# EAGLE design Ilumitunes-IR-Breakout-v11 (EAGLE 5.10)
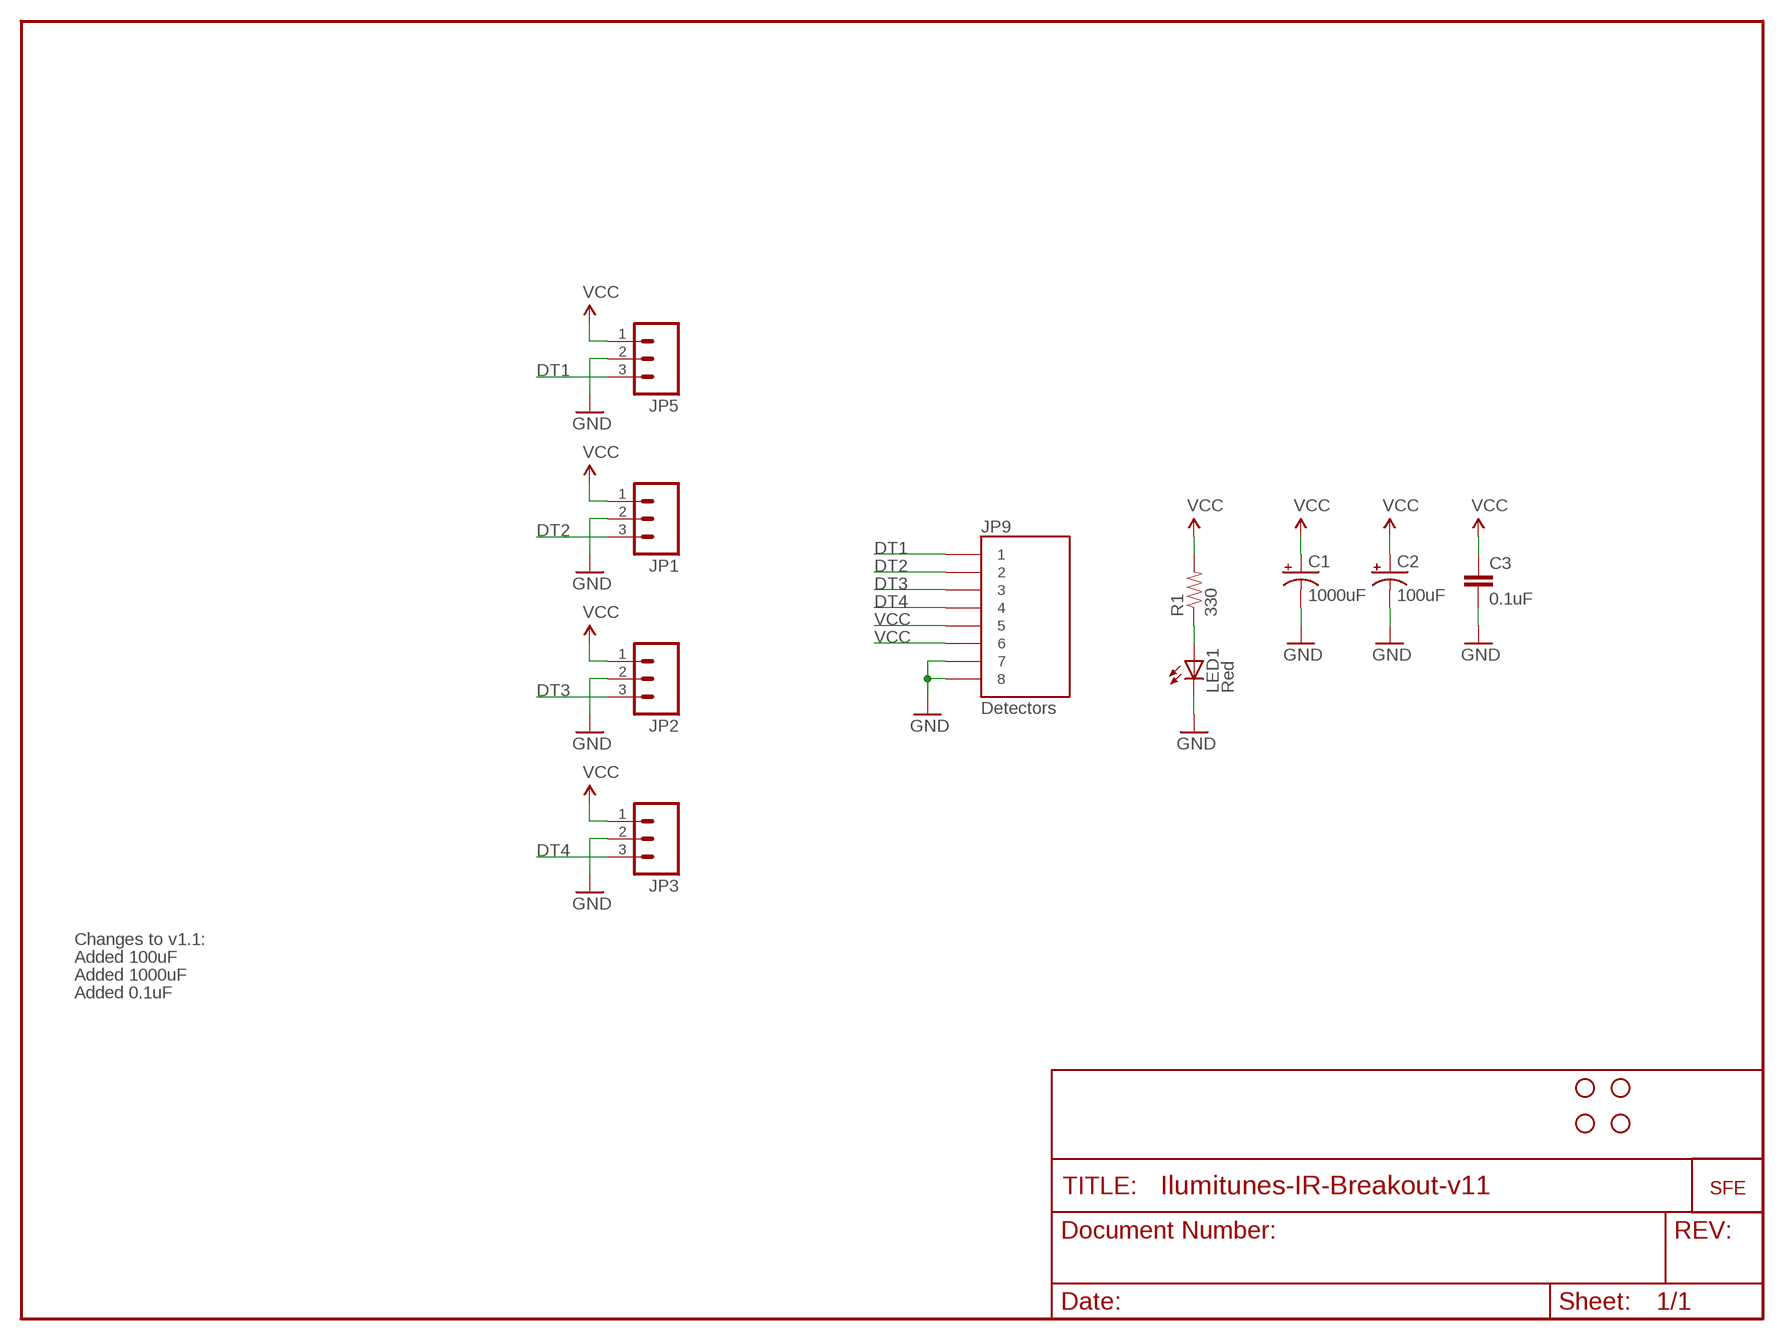
[diagram p0: schematic, sheet 1]

## Parts
C1  1000uF  CAP_POLPTH4  [CPOL-RADIAL-1000UF-25V]
C2  100uF  CAP_POLPTH1  [CPOL-RADIAL-100UF-25V]
C3  0.1uF  CAPPTH2  [CAP-PTH-SMALL2]
JP1  M03JST-PTH-VERT  [JST-3-PTH-VERT]
JP2  M03JST-PTH-VERT  [JST-3-PTH-VERT]
JP3  M03JST-PTH-VERT  [JST-3-PTH-VERT]
JP4  STAND-OFF  [STAND-OFF]
JP5  M03JST-PTH-VERT  [JST-3-PTH-VERT]
JP6  STAND-OFF  [STAND-OFF]
JP7  STAND-OFF  [STAND-OFF]
JP8  STAND-OFF  [STAND-OFF]
JP9  Detectors  RJ45-8PTH  [RJ45-8]
LED1  Red  LED5MM  [LED5MM]
R1  330  RESISTORAXIAL-0.3  [AXIAL-0.3]
U$1  LOGO-SFESK  [SFE-LOGO-FLAME]

## Nets
DT1: JP5.3 JP9.1
DT2: JP1.3 JP9.2
DT3: JP2.3 JP9.3
DT4: JP3.3 JP9.4
GND: C1.2(-) C2.2(-) C3.2 JP1.2 JP2.2 JP3.2 JP5.2 JP9.7 JP9.8 LED1.K(C)
N$1: LED1.A R1.P$1
VCC [vcc]: C1.1(+) C2.1(+) C3.1 JP1.1 JP2.1 JP3.1 JP5.1 JP9.5 JP9.6 R1.P$2

## Notes on the sheet
- Changes to v1.1:
- Added 100uF
- Added 1000uF
- Added 0.1uF

## Library data of the parts
C1 C2 = SparkFun:CAP_POL: Capacitor Polarized These are standard SMD and PTH capacitors. Normally 10uF, 47uF, and 100uF in electrolytic and tantalum varieties. Always verify the external diameter of the through hole cap, it varies with capacity, voltage, and manufacturer. The EIA devices should be standard.
C3 = SparkFun:CAP: Capacitor Standard 0603 ceramic capacitor, and 0.1" leaded capacitor.
JP1-JP3 JP5 = SparkFun:M03: Header 3 Standard 3-pin 0.1" header. Use with straight break away headers (SKU : PRT-00116), right angle break away headers (PRT-00553), swiss pins (PRT-00743), machine pins (PRT-00117), and female headers (PRT-00115). Molex polarized connector foot print use with SKU : PRT-08232 with associated crimp pins and housings.
JP4 JP6-JP8 = SparkFun:STAND-OFF: Stand Off This is the mechanical footprint for a #4 phillips button head screw. Use the keepout ring to avoid running the screw head into surrounding components. SKU : PRT-00447
JP9 = SparkFun:RJ45-8: RJ45 Jack Simple RJ45, 8-pin connection - connector for common Cat5, Cat5e, and Cat6 Ethernet cables. Footprint not yet proven in production. Connector sku is PRT-00643; Breakout PCB sku is BOB-00716.
LED1 = SparkFun:LED: LEDs Standard schematic elements and footprints for 5mm, 3mm, 1206, and 0603 sized LEDs. 5mm - Spark Fun Electronics SKU : COM-00529 (and others)
R1 = SparkFun:RESISTOR: Resistor Basic schematic elements and footprints for 0603, 1206, and PTH resistors.
U$1 = SparkFun:LOGO-SFE: Spark Fun Electronics PCB Logo This is the standard Spark Fun Electronics PCB logo.

## Net classes
1 vcc: width 0.508 mm

## Board
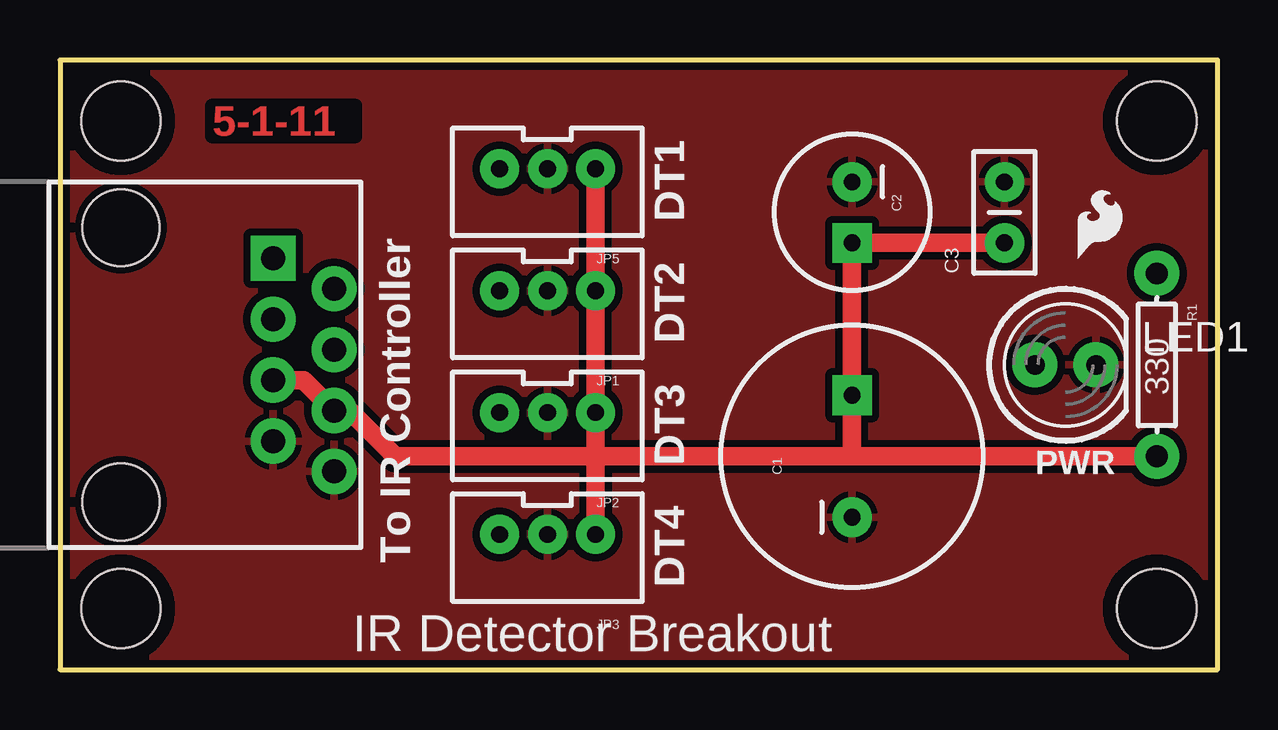
[diagram p1: board, top side]
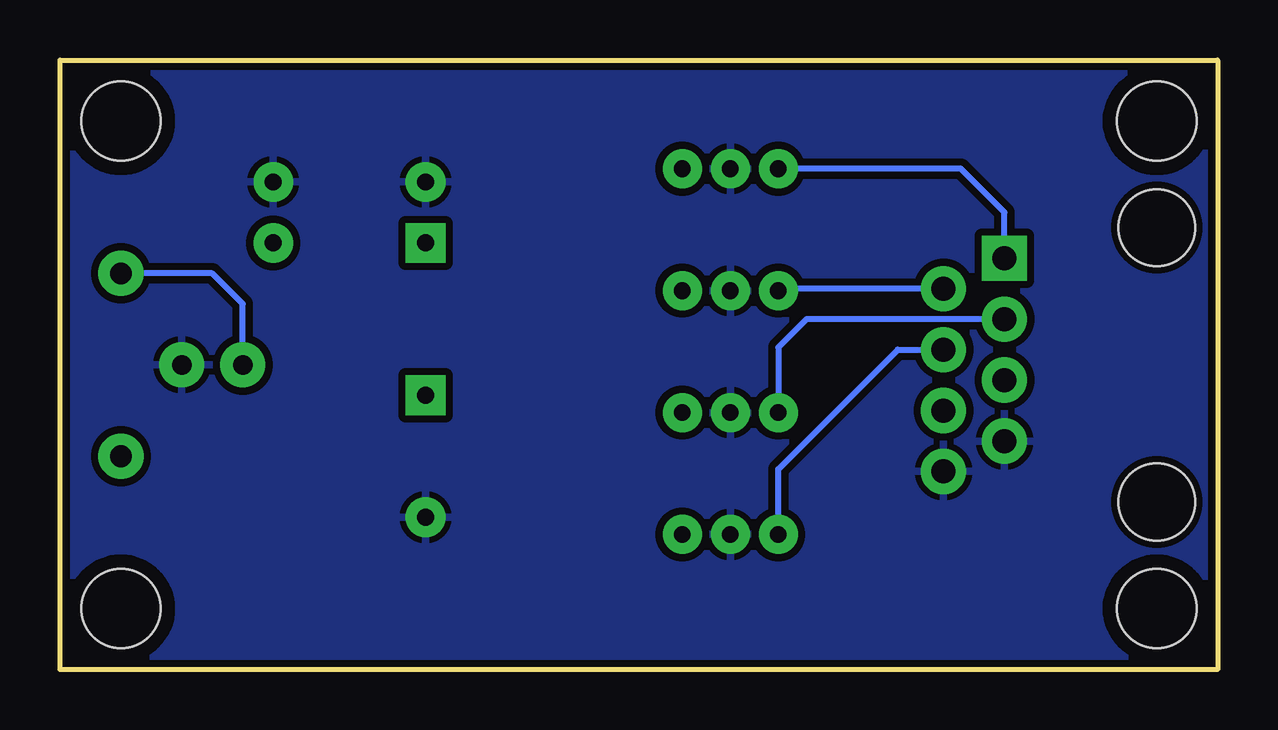
[diagram p2: board, bottom side, seen from below]

Size 48.26 x 25.4 mm. Coordinates in mm from the lower left corner, seen from the top.
Outline: 48.26,25.4 0,25.4 0,0 48.26,0 48.26,25.4
Copper layers (1*16): Top 0.035mm / dielectric 1.5mm / Bottom 0.035mm
Design rules "SparkFun *": minimum track width 10mil, minimum drill 20mil, track to track 8mil, track to pad 8mil, pad to pad 8mil, via to via 8mil, smd to smd 8mil, copper to edge 10mil, drill to drill 8mil, minimum pad ring 12mil, minimum via ring 10mil, stop-mask expansion 4mil, vias tented up to drill 25mil, thermal gap 10mil

### Footprints (pad centres in the part's own frame; a part is rotated, then mirrored left to right if it is on the bottom)
CPOL-RADIAL-1000UF-25V = drill 0.7 pad 1.651 square: 1 2.54,0 | drill 0.7 pad 1.651 round: 2 -2.54,0
CPOL-RADIAL-100UF-25V = drill 0.7 pad 1.651 square: 1 1.27,0 | drill 0.7 pad 1.651 round: 2 -1.27,0
CAP-PTH-SMALL2 = drill 0.7 pad 1.651 round: 1 0,0; 2 2.54,0
JST-3-PTH-VERT = drill 0.7 pad 1.626 round: 1 -2,-0.55; 2 0,-0.55; 3 2,-0.55
STAND-OFF = hole 3.302: 0,0
RJ45-8 = drill 1 pad 1.88 square: 1 -4.445,6.35 | drill 1 pad 1.88 round: 2 -3.175,8.89; 3 -1.905,6.35; 4 -0.635,8.89; 5 0.635,6.35; 6 1.905,8.89; 7 3.175,6.35; 8 4.445,8.89 | hole 3.2: -5.715,0; 5.715,0
LED5MM = drill 0.813 pad 1.88 round: A -1.27,0; K 1.27,0
AXIAL-0.3 = drill 0.9 pad 1.88 round: P$1 -3.81,0; P$2 3.81,0

### Placement (x,y rotation side)
C1  33.02,8.89 90 top
C2  33.02,19.05 270 top
C3  39.37,17.78 90 top
JP1  20.32,15.24 180 top
JP2  20.32,10.16 180 top
JP3  20.32,5.08 180 top
JP4  2.54,2.54 0 top
JP5  20.32,20.32 180 top
JP6  2.54,22.86 0 top
JP7  45.72,22.86 0 top
JP8  45.72,2.54 0 top
JP9  2.54,12.7 270 top
LED1  41.91,12.7 0 top
R1  45.72,12.7 270 top
U$1  42.42,17.14 0 top

### Tracks (layer width: path | path; a pad name or v marks a point on that pad's centre or on a via)
DT1
  Bottom 0.254: JP5.3 10.71,20.87 8.89,19.05 JP9.1
DT2
  Bottom 0.254: JP9.2 18.23,15.88 JP1.3
DT3
  Bottom 0.254: JP9.3 17.14,14.61 18.32,13.43 JP2.3
DT4
  Bottom 0.254: JP9.4 13.34,13.34 18.32,8.35 JP3.3
GND
  pour Top (isolate 0.305): 0,0 0,25.4 48.26,25.4 48.26,0
  pour Bottom (isolate 0.305): 0,0 0,25.4 48.26,25.4 48.26,0
N$1
  Bottom 0.254: LED1.A 40.64,15.24 41.91,16.51 R1.P$1
VCC
  Top 0.762: JP5.1 JP1.1 JP2.1 22.32,8.89 | 22.32,8.89 JP3.1 | 22.32,8.89 13.97,8.89 12.06,10.79 JP9.6 10.16,12.06 JP9.5 | 22.32,8.89 33.02,8.89 | 33.02,8.89 R1.P$2 | 33.02,8.89 C1.1 C2.1 C3.1

### Text on the board
Top: 5-1-11
tPlace: DT1 | DT2 | DT3 | PWR | To IR Controller | DT4 | IR Detector Breakout